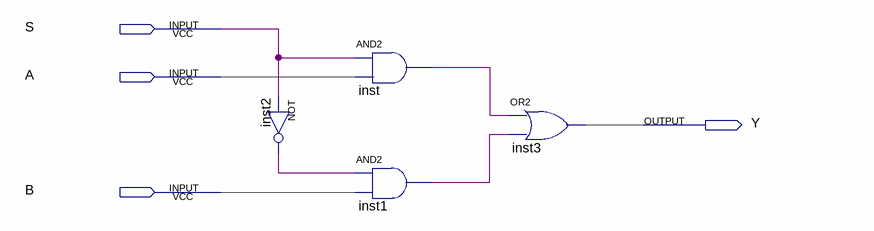
[diagram p0: schematic sheet]
// Quartus schematic LAB01DT_EXERCISE_Cau2.bdf as structural Verilog: 4 symbols, 4 pins
module LAB01DT_EXERCISE_Cau2 (
  input  S,
  input  A,
  input  B,
  output Y
);

  wire inst1_out, inst2_out, inst3_out, inst_out;

  not inst2 (inst2_out, S);
  buf inst (inst_out, S);  // AND2 open: IN2
  buf inst1 (inst1_out, inst2_out);  // AND2 open: IN2
  or inst3 (inst3_out, inst_out, inst1_out);
endmodule
